# Altium schematic sheet STM32_Schematic.SchDoc
size A3; SheetNumber: 1; SheetTotal: 4
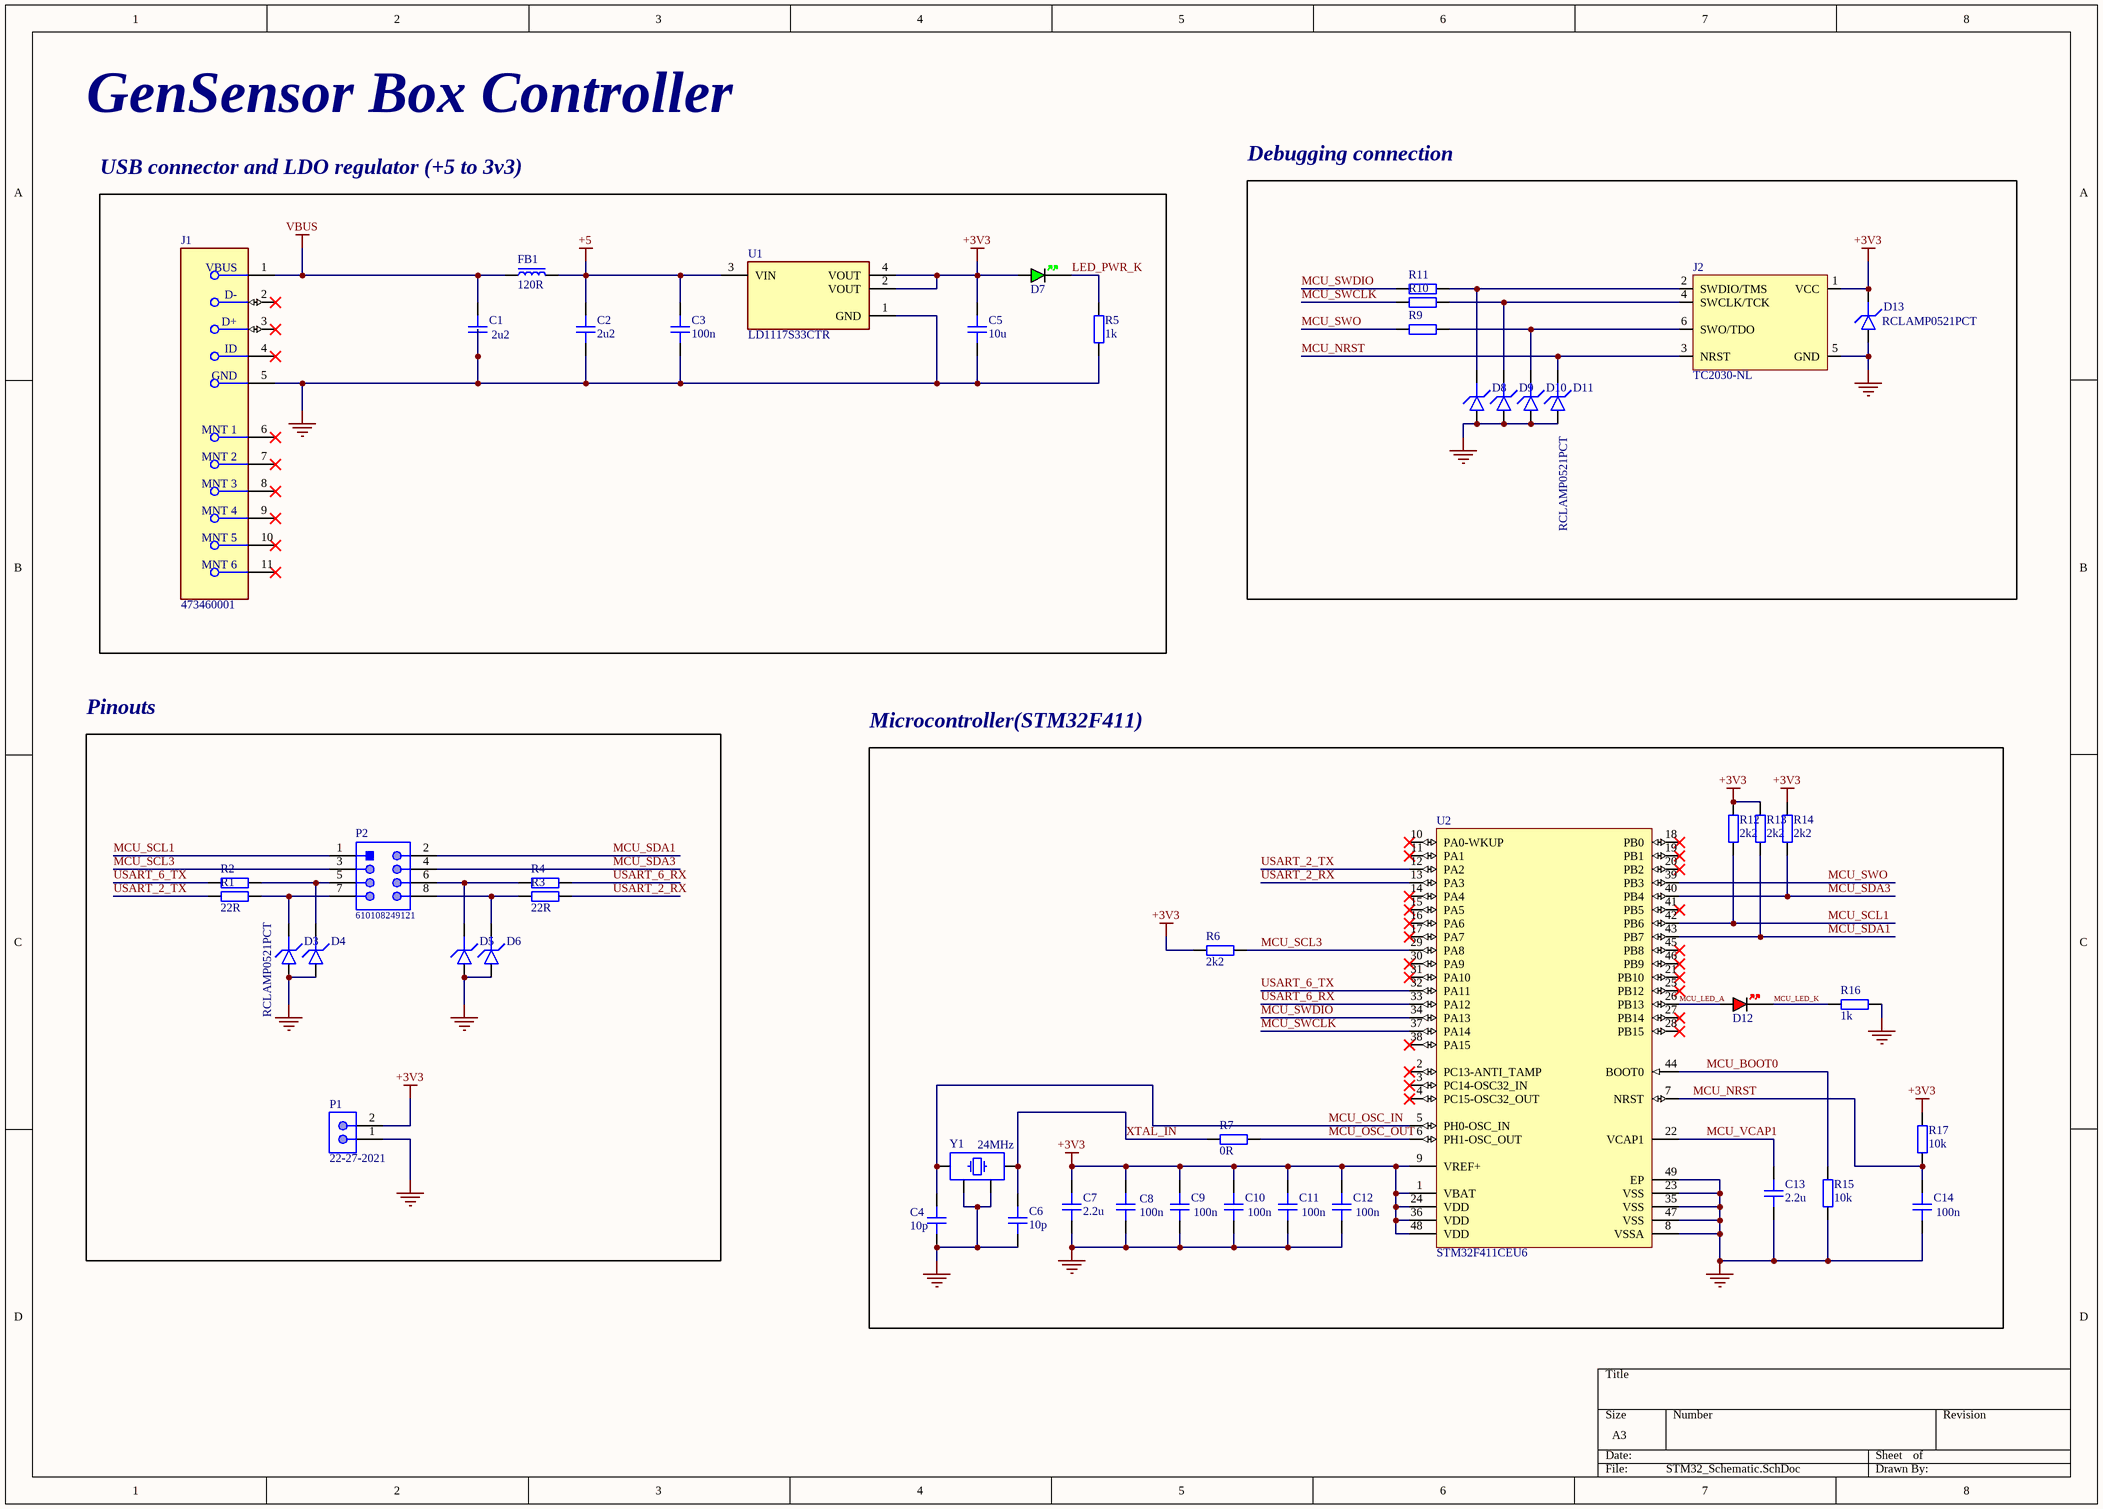
[diagram p0: STM32_Schematic.SchDoc]

## Parts
C1  2u2  [CAP_0603]
C2  2u2  [CAP_0603]
C3  100n  [CAP_0805]
C4  10p  [CAP_0402]
C5  10u  [CAP_0805]
C6  10p  [CAP_0402]
C7  2.2u  [CAP_0603]
C8  100n  [CAP_0402]
C9  100n  [CAP_0402]
C10  100n  [CAP_0402]
C11  100n  [CAP_0402]
C12  100n  [CAP_0402]
C13  2.2u  [CAP_0603]
C14  100n  [CAP_0402]
D3  RCLAMP0521PCT  [D_0402]
D4  RCLAMP0521PCT  [D_0402]  (value not drawn)
D5  RCLAMP0521PCT  [D_0402]  (value not drawn)
D6  RCLAMP0521PCT  [D_0402]  (value not drawn)
D7  GREEN  [LED_0402_GREEN]  (value not drawn)
D8  RCLAMP0521PCT  [D_0402]  (value not drawn)
D9  RCLAMP0521PCT  [D_0402]  (value not drawn)
D10  RCLAMP0521PCT  [D_0402]  (value not drawn)
D11  RCLAMP0521PCT  [D_0402]
D12  RED  [LED_0402_RED]  (value not drawn)
D13  RCLAMP0521PCT  [D_0402]
FB1  120R  [FB_0603]
J1  473460001  [FP-473460001-MFG]
J2  TC2030-NL  [TC2030-NL-FP]  (no BOM)
P1  22-27-2021  [MOLX-22-27-2021_V]
P2  610108249121  [610108249121]
R1  22R  [RES_0402]
R2  22R  [RES_0402]  (value not drawn)
R3  22R  [RES_0402]
R4  22R  [RES_0402]  (value not drawn)
R5  1k  [RES_0402]
R6  2k2  [RES_0402]
R7  0R  [RES_0402]
R9  22R  [RES_0402]  (value not drawn)
R10  22R  [RES_0402]  (value not drawn)
R11  22R  [RES_0402]  (value not drawn)
R12  2k2  [RES_0402]
R13  2k2  [RES_0402]
R14  2k2  [RES_0402]
R15  10k  [RES_0402]
R16  1k  [RES_0402]
R17  10k  [RES_0402]
U1  LD1117S33CTR  [FP-SOT-223-0046067_14-MFG]
U2  STM32F411CEU6  [STM-UFQFPN48_L]
Y1  24MHz  [XTAL_3225]

## Blocks framed on the sheet
USB connector and LDO regulator (+5 to 3v3): C1-C3 C5 D7 FB1 J1 R5 U1
Debugging connection: D8-D11 D13 J2 R9-R11
Pinouts: D3-D6 P1 P2 R1-R4
Microcontroller(STM32F411): C4 C6-C14 D12 R6 R7 R12-R17 U2 Y1

## Nets
+3V3: C5.2 C7.2 C8.2 C9.2 C10.2 C11.2 C12.2 D7.A D13.K J2.1(VCC) P1.2 R6.2 R12.2 R13.2 R14.2 R17.2 U1.2(VOUT) U1.4(VOUT) U2.1(VBAT) U2.9(VREF+) U2.24(VDD) U2.36(VDD) U2.48(VDD)
+5: C2.2 C3.2 FB1.2 U1.3(VIN)
GND: C1.1 C2.1 C3.1 C4.1 C5.1 C6.1 C7.1 C8.1 C9.1 C10.1 C11.1 C12.1 C13.1 C14.1 D3.A D4.A D5.A D6.A D8.A D9.A D10.A D11.A D13.A J1.5(GND) J2.5(GND) P1.1 R5.1 R15.1 R16.1 U1.1(GND) U2.8(VSSA) U2.23(VSS) U2.35(VSS) U2.47(VSS) U2.49(EP) Y1.2 Y1.4
VBUS: C1.2 FB1.1 J1.1(VBUS)
LED_PWR_K: D7.K R5.2
MCU_BOOT0: R15.2 U2.44(BOOT0)
MCU_LED_A: D12.A U2.26(PB13)
MCU_LED_K: D12.K R16.2
MCU_NRST: C14.2 D11.K J2.3(NRST) R17.1 U2.7(NRST)
MCU_OSC_IN: C4.2 U2.5(PH0-OSC_IN) Y1.1
MCU_OSC_OUT: R7.2 U2.6(PH1-OSC_OUT)
MCU_SCL1: P2.1 R12.1 U2.42(PB6)
MCU_SCL3: P2.3 R6.1 U2.29(PA8)
MCU_SDA1: P2.2 R13.1 U2.43(PB7)
MCU_SDA3: P2.4 R14.1 U2.40(PB4)
MCU_SWCLK: R10.2 U2.37(PA14)
MCU_SWDIO: R11.2 U2.34(PA13)
MCU_SWO: R9.2 U2.39(PB3)
MCU_VCAP1: C13.2 U2.22(VCAP1)
USART_2_RX: R3.1 U2.13(PA3)
USART_2_TX: R1.2 U2.12(PA2)
USART_6_RX: R4.1 U2.33(PA12)
USART_6_TX: R2.2 U2.32(PA11)
XTAL_IN: C6.2 R7.1 Y1.3
NetD3_K: D3.K P2.7 R1.1
NetD4_K: D4.K P2.5 R2.1
NetD5_K: D5.K P2.6 R4.2
NetD6_K: D6.K P2.8 R3.2
NetD8_K: D8.K J2.2(SWDIO/TMS) R11.1
NetD9_K: D9.K J2.4(SWCLK/TCK) R10.1
NetD10_K: D10.K J2.6(SWO/TDO) R9.1

Not connected (* = marked no-connect by the designer): J1 2(D-)* 3(D+)* 4(ID)* 6(MNT_1)* 7(MNT_2)* 8(MNT_3)* 9(MNT_4)* 10(MNT_5)* 11(MNT_6)*; U2 2(PC13-ANTI_TAMP)* 3(PC14-OSC32_IN)* 4(PC15-OSC32_OUT)* 10(PA0-WKUP)* 11(PA1)* 14(PA4)* 15(PA5)* 16(PA6)* 17(PA7)* 18(PB0)* 19(PB1)* 20(PB2)* 21(PB10)* 25(PB12)* 27(PB14)* 28(PB15)* 30(PA9)* 31(PA10)* 38(PA15)* 41(PB5)* 45(PB8)* 46(PB9)*

## Notes on the sheet
- GenSensor Box Controller

## Library data of the parts
C1 C2 C7 C13 = CAP_0603_16V: Capacitor SMD 0603 16V
C3 C5 = CAP_0805_16V: Capacitor SMD 0805 16V
C4 C6 C8-C12 C14 = CAP_0402_16V: Capacitor SMD 0402 16V
D3-D6 D8-D11 D13 = D_TVS_0402: Diode TVS / ESD 0402
D7 = LED_0402_GREEN: LED 0402 GREEN SMD
D12 = LED_0402_RED: LED 0402 RED SMD
FB1 = FB_0603: Ferrite Bead SMD 0603
J1 = CMP-2000-05246-2: CONN RCPT USB2.0 MICRO B SMD R/A; Manufacturer: Molex; Conn Orientation: Right Angle; Is Female: yes; Shielding: true; Pitch: 0.65mm; Number Of Contacts: 5; Voltage Rating: 30V; Current Rating: 1.8A; Device Class L2: USB Connectors; Digikey Description: CONN RCPT USB2.0 MICRO B SMD R/A; Height: 2.945mm; RoHS: TRUE; ComponentLink2Description: Datasheet; Octopart: https://octopart.com/47346-0001-molex-7164928; Automotive: No; Package: 0; Category: Conn; Device Class L1: Connectors; Usb Standard: USB 2.0; Temperature: -30°C to +85°C; Temperature Range Low: -30°C; Footprint Url: https://www.molex.com/pdm_docs/sd/473460001_sd.pdf; ComponentLink2URL: https://www.molex.com/webdocs/datasheets/pdf/en-us/0473460001_IO_CONNECTORS.pdf; Lead Free: Yes; Manufacturer Part Number: 473460001; Contact Material: Gold,Nickel; Temperature Range High: +85°C; Device Class L3: unset
J2 = TC2030-NL: Tag-Connect No-Solder SWD Debug Connector (No Legs) DO NOT PLACE; Manufacturer: Tag-Connect; Manufacturer Part Number: TC2030-NL-FP
P1 = CMP-2000-05537-1: Male Header, Pitch 2.54 mm, 1 x 2 Position, Height 11.7 mm, Tail Length 3.56 mm, 0 to 75 degC, RoHS, Bulk; Manufacturer: Molex; PartNumber: 0022272021; Current rating: 4A; Package Version: Rev. BC, 02/2012; Voltage rating: 250V; No. of Positions: 2; Pitch: 2.54mm; No. of Rows: 1; Orientation: Vertical; Operating temperature: 0°Cto+75°C; Manufacturer URL: http://www.molex.com/; Mounting Technology: ThroughHole; Housing material: Nylon(UL94V-0); Package Description: 2-Leads Header, Body 5.08 x 5.8 mm, Pitch 2.54 mm; Voltage - Max: 250V; Datasheet URL: http://www.molex.com/pdm_docs/sd/022272021_sd.pdf; Package Reference: 22-27-2021; Contact material: Tinplatedbrass; Current - Max: 4A; Datasheet Version: Rev. F, 06/2009
P2 = CMP-1502-01147-1: SMT Angled Pin Header WR-PHD, Pitch 2.54 mm, Dual Row, 8 pins; Manufacturer: Wurth Elektronik; Pitch: 2.54mm; Working Voltage: 250VAC; Rated Current: 3A; Pin Number: 8; Gender: Male; Contact Resistance: 20mOhm; Withstanding Voltage: 600VAC; Row Number: Dual; Operating Temperature: -40to105degC; Part Number: 610108249121; Publisher: WurthElektronik; Datasheet URL: https://katalog.we-online.de/em/datasheet/6101xx249121.pdf; Package Reference: 610108249121; Manufacturer URL: http://www.we-online.de; Orientation: Angled; Mounting Technology: SMT; Packaging: TapeandReel
R1-R7 R9-R17 = RES_0402: Resistor SMD 0402
U1 = CMP-0244-00307-2: IC REG LINEAR 3.3V 800MA SOT223; Input Bias Current: 5mA; Output Voltage Accuracy: 1%; Dropout Voltage: 1.1V; Power Dissipation: 12W; Polarity: Positive; Min Input Voltage: 5.3V; Quiescent Current: 10mA; Max Output Current: 1.3A; Output Current: 950mA; Number of Regulators: 1; Max Supply Voltage: 15V; Output Type: Fixed; Output Voltage: 3.3V; Number of Terminals: 4; Min Supply Voltage: 3.3V; Termination: SMD/SMT; Mount: Surface Mount; Max Power Dissipation: 12W; Case/Package: SOT-223; Lead Free: Lead Free; Height: 1.8mm; REACH SVHC: No SVHC; Radiation Hardening: No; Width: 3.5mm; Length: 6.5mm; Packaging: Tape and Reel; Max Input Voltage: 15V; Accuracy: 1%; Weight: 0.01lb; Contact Plating: Tin; Max Operating Temperature: 125°C; Number of Pins: 4; Max Output Voltage: 3.3V; Min Operating Temperature: -40°C; Nominal Output Voltage: 3.3V; Package Quantity: 1; Min Output Voltage: 3.3V; Number of Outputs: 1
U2 = CMP-0243-00165-1: ARM Cortex-M4 32-bit MCU+FPU, 512 KB Flash, 128 KB RAM, 36 I/Os, 48-Pin UFQFPN, -40 to 85 degC, Tray; Operating Frequency(F) (Processor speed) (MHz): 100; FLASH Size (Prog) (kB): 512; Internal RAM Size (kB): 128; I/Os (High Current): 36; Supply Voltage(Vcc) min (V): 1.7; Package Reference: 48-Pin Ultra Thin Fine Pitch Quad Flat No-Lead, 7 x 7 x 0.6 mm Body, 0.5 mm Pitch, Exposed Pad; ComponentLink1Description: Manufacturer URL; ComponentLink1URL: http://www.st.com/; Packing: Tray; Package Description: UFQFPN48; Core: ARM Cortex-M4; ComponentLink2Description: Datasheet; ComponentLink2URL: http://www.st.com/st-web-ui/static/active/en/resource/technical/document/datasheet/DM00115249.pdf; DatasheetVersion: Rev. 6; Mounting Technology: Surface Mount
Y1 = TSX-3225_24.0000MF15X-AC: Crystal SMD 24MHz 10PPM 7pF 3225; Manufacturer: Epson; Manufacturer Number: TSX-3225 24.0000MF15X-AC; ESR: 40R; Value: 24MHz; Type: XTAL; Load Capacitance: 7pF